# Altium project PCB_Project1.PrjPCB
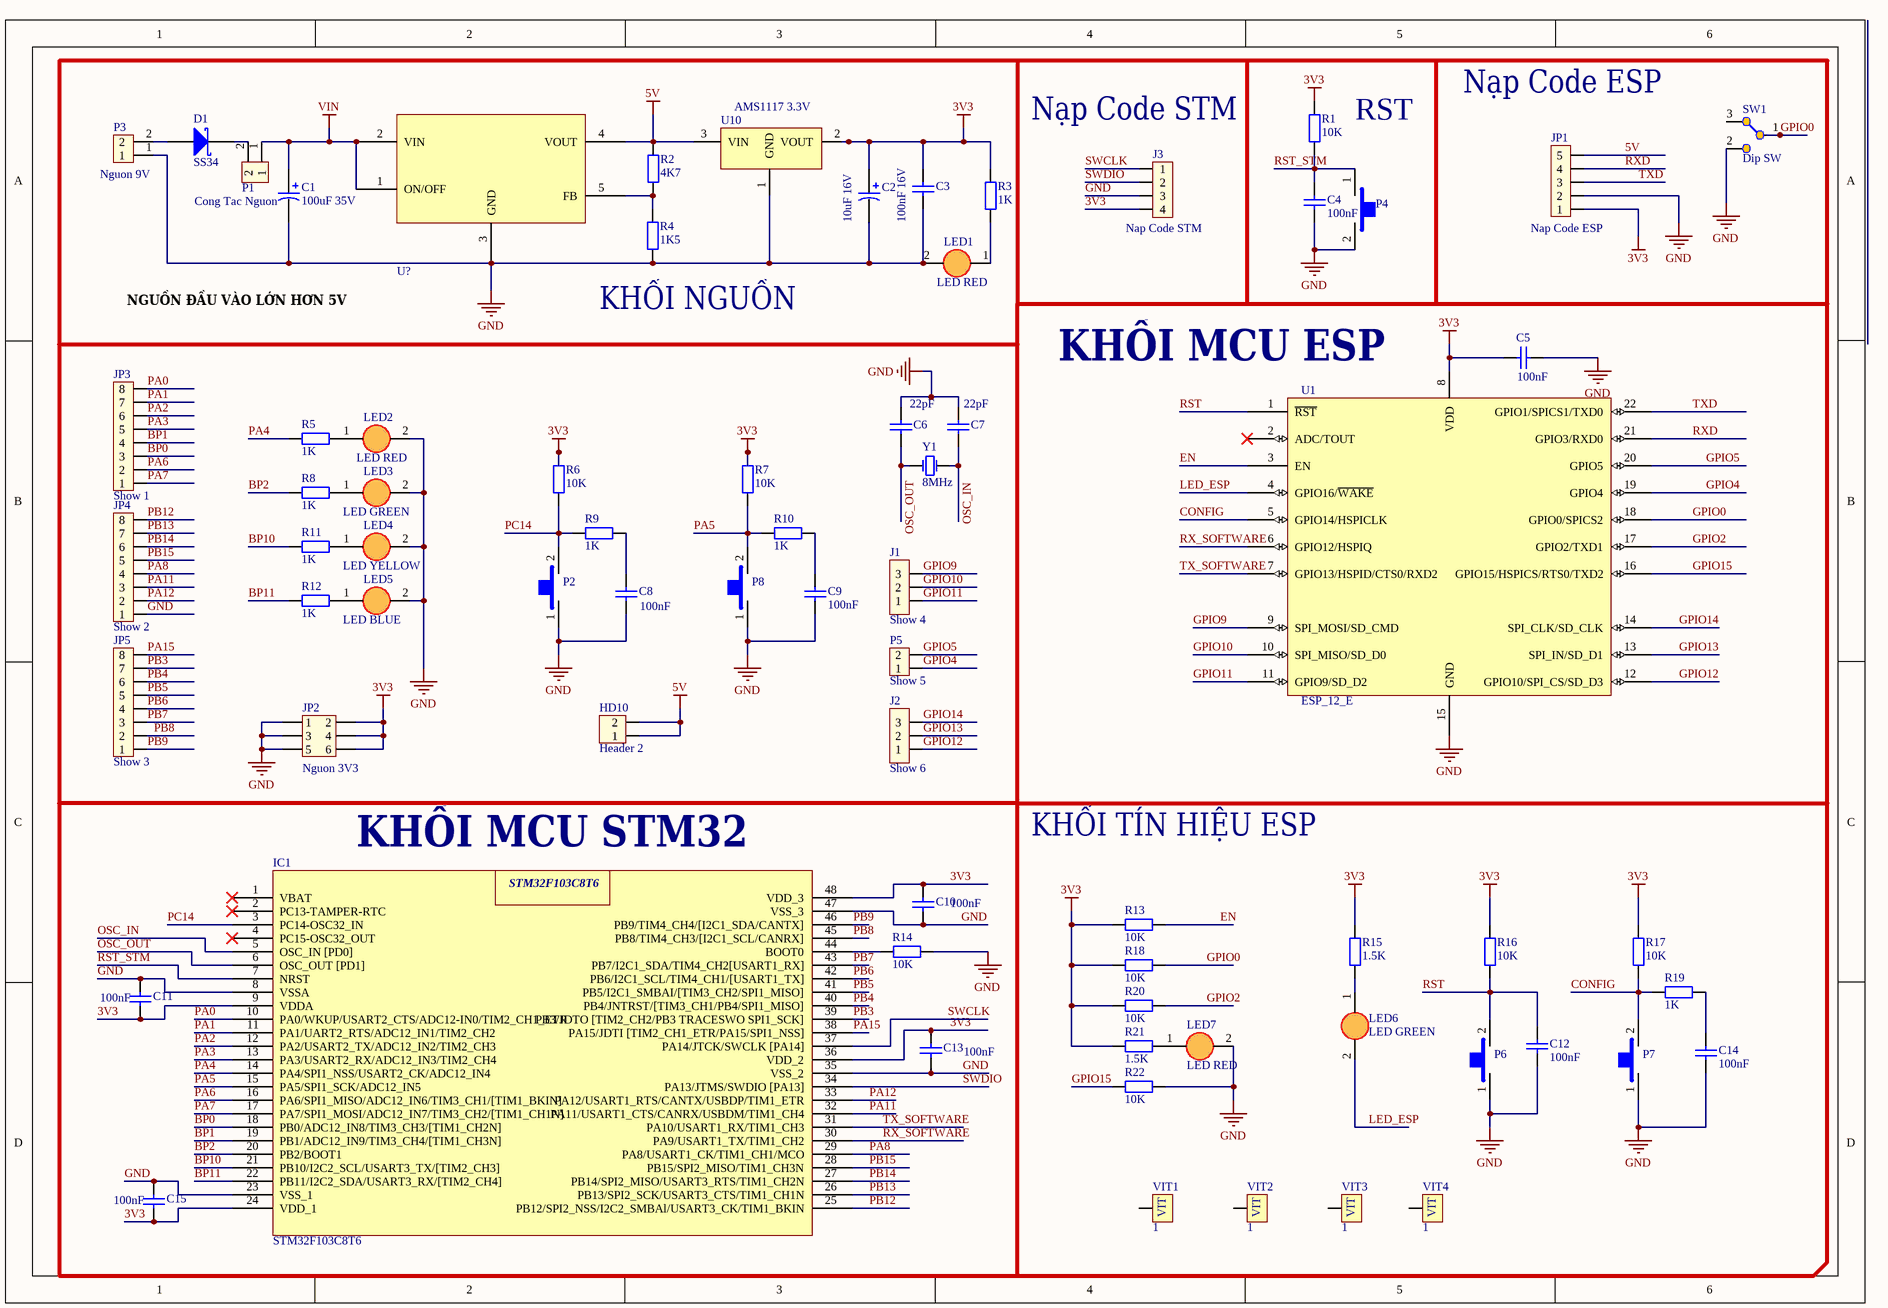
[diagram p0: Sheet1.SchDoc]
1 sheet, 72 parts. Net scope: global (net labels, ports and power ports of the same name join across sheets).

## Sheet Sheet1.SchDoc
size 350 x 241 mm

### Parts
C1  100uF 35V  [CAP_ALUM_SMD_100102_TYPE_G]
C2  10uF 16V  [CAP_ALUM_SMD_5054_TYPE_C]
C3  100nF 16V  [tu 0805]
C4  100nF  [tu 0805]
C5  100nF  [tu 0805]
C6  22pF  [tu 0805]
C7  22pF  [tu 0805]
C8  100nF  [tu 0805]
C9  100nF  [tu 0805]
C10  100nF  [tu 0805]
C11  100nF  [tu 0805]
C12  100nF  [tu 0805]
C13  100nF  [tu 0805]
C14  100nF  [tu 0805]
C15  100nF  [tu 0805]
D1  SS34  [DIODE_DO214AC_SMA]
HD10  Header 2  [Header_2]
IC1  STM32F103C8T6  [LQFP48]
J1  Show 4  [JP3]
J2  Show 6  [JP3]
J3  Nap Code STM  [jump don duc thang 2.54_4p]
JP1  Nap Code ESP  [jump don duc 2.54_5p]
JP2  Nguon 3V3  [Jump Doi Duc Thang 2.54_3x2]
JP3  Show 1  [Jump Don Duc Thang 2.54_8p]
JP4  Show 2  [Jump Don Duc Thang 2.54_8p]
JP5  Show 3  [Jump Don Duc Thang 2.54_8p]
LED1  LED RED  [led 0805]
LED2  LED RED  [led 0805]
LED3  LED GREEN  [led 0805]
LED4  LED YELLOW  [led 0805]
LED5  LED BLUE  [led 0805]
LED6  LED GREEN  [led 0805]
LED7  LED RED  [led 0805]
MIC?  U?  [Mic5V]
P1  Cong Tac Nguon  [Header Duc Thang 2P 2.54]
P2  (no value)  [SW 2P SMD]
P3  Nguon 9V  [Header Duc Thang 2P 2.54]
P4  (no value)  [SW 2P SMD]
P5  Show 5  [Jump don duc 2.54_2P]
P6  (no value)  [SW 2P SMD]
P7  (no value)  [SW 2P SMD]
P8  (no value)  [SW 2P SMD]
R1  10K  [tro 0805]
R2  4K7  [tro 0805]
R3  1K  [tro 0805]
R4  1K5  [tro 0805]
R5  1K  [tro 0805]
R6  10K  [tro 0805]
R7  10K  [tro 0805]
R8  1K  [tro 0805]
R9  1K  [tro 0805]
R10  1K  [tro 0805]
R11  1K  [tro 0805]
R12  1K  [tro 0805]
R13  10K  [tro 0805]
R14  10K  [tro 0805]
R15  1.5K  [tro 0805]
R16  10K  [tro 0805]
R17  10K  [tro 0805]
R18  10K  [tro 0805]
R19  1K  [tro 0805]
R20  10K  [tro 0805]
R21  1.5K  [tro 0805]
R22  10K  [tro 0805]
SW1  Dip SW  [SW3P]
U1  ESP_12_E  [ESP8266_12_E_L]
U10  AMS1117 3.3V  [SOT223]
VIT1  1  [VIT]
VIT2  1  [VIT]
VIT3  1  [VIT]
VIT4  1  [VIT]
Y1  8MHz  [thach anh 49s smd]

### Nets
3V3: C2.1 C3.1 C5.1 C10.1 C11.2 C13.1 C15.2 IC1.9(VDDA) IC1.24(VDD_1) IC1.36(VDD_2) IC1.48(VDD_3) J3.4 JP1.1 JP2.2 JP2.4 JP2.6 R1.1 R3.2 R6.1 R7.1 R13.2 R15.1 R16.1 R17.1 R18.2 R20.2 R21.2 U1.8(VDD) U10.2(VOUT)
5V: HD10.1 HD10.2 JP1.5 MIC?.4(VOUT) R2.2 U10.3(VIN)
GND: C1.2 C2.2 C3.2 C4.2 C5.2 C6.1 C7.1 C8.2 C9.2 C10.2 C11.1 C12.2 C13.2 C14.2 C15.1 IC1.8(VSSA) IC1.23(VSS_1) IC1.35(VSS_2) IC1.47(VSS_3) J3.3 JP1.2 JP2.1 JP2.3 JP2.5 JP4.1 LED1.2(K) LED2.2(K) LED3.2(K) LED4.2(K) LED5.2(K) LED7.2(K) MIC?.3(GND) P2.1 P3.1 P4.2 P6.1 P7.1 P8.1 R4.1 R14.1 R22.1 SW1.2(NC) U1.15(GND) U10.1(GND)
VIN: C1.1 MIC?.1(ON/OFF) MIC?.2(VIN) P1.1
BP0: IC1.18(PB0/ADC12_IN8/TIM3_CH3/[TIM1_CH2N]) JP3.3
BP1: IC1.19(PB1/ADC12_IN9/TIM3_CH4/[TIM1_CH3N]) JP3.4
BP2: IC1.20(PB2/BOOT1) R8.2
BP10: IC1.21(PB10/I2C2_SCL/USART3_TX/[TIM2_CH3]) R11.2
BP11: IC1.22(PB11/I2C2_SDA/USART3_RX/[TIM2_CH4]) R12.2
CONFIG: P7.2 R17.2 R19.2 U1.5(GPIO14/HSPICLK)
EN: R13.1 U1.3(EN)
GPIO0: R18.1 SW1.1(COM) U1.18(GPIO0/SPICS2)
GPIO2: R20.1 U1.17(GPIO2/TXD1)
GPIO4: P5.1 U1.19(GPIO4)
GPIO5: P5.2 U1.20(GPIO5)
GPIO9: J1.3 U1.9(SPI_MOSI/SD_CMD)
GPIO10: J1.2 U1.10(SPI_MISO/SD_D0)
GPIO11: J1.1 U1.11(GPIO9/SD_D2)
GPIO12: J2.1 U1.12(GPIO10/SPI_CS/SD_D3)
GPIO13: J2.2 U1.13(SPI_IN/SD_D1)
GPIO14: J2.3 U1.14(SPI_CLK/SD_CLK)
GPIO15: R22.2 U1.16(GPIO15/HSPICS/RTS0/TXD2)
LED_ESP: LED6.2(K) U1.4(GPIO16/~{WAKE})
OSC_IN: C7.2 IC1.5(OSC_IN_[PD0]) Y1.2(OSC2)
OSC_OUT: C6.2 IC1.6(OSC_OUT_[PD1]) Y1.1(OSC1)
PA0: IC1.10(PA0/WKUP/USART2_CTS/ADC12-IN0/TIM2_CH1_ETR) JP3.8
PA1: IC1.11(PA1/UART2_RTS/ADC12_IN1/TIM2_CH2) JP3.7
PA2: IC1.12(PA2/USART2_TX/ADC12_IN2/TIM2_CH3) JP3.6
PA3: IC1.13(PA3/USART2_RX/ADC12_IN3/TIM2_CH4) JP3.5
PA4: IC1.14(PA4/SPI1_NSS/USART2_CK/ADC12_IN4) R5.2
PA5: IC1.15(PA5/SPI1_SCK/ADC12_IN5) P8.2 R7.2 R10.2
PA6: IC1.16(PA6/SPI1_MISO/ADC12_IN6/TIM3_CH1/[TIM1_BKIN]) JP3.2
PA7: IC1.17(PA7/SPI1_MOSI/ADC12_IN7/TIM3_CH2/[TIM1_CH1N]) JP3.1
PA8: IC1.29(PA8/USART1_CK/TIM1_CH1/MCO) JP4.4
PA11: IC1.32(PA11/USART1_CTS/CANRX/USBDM/TIM1_CH4) JP4.3
PA12: IC1.33(PA12/USART1_RTS/CANTX/USBDP/TIM1_ETR) JP4.2
PA15: IC1.38(PA15/JDTI_[TIM2_CH1_ETR/PA15/SPI1_NSS]) JP5.8
PB3: IC1.39(PB3/JDTO_[TIM2_CH2/PB3_TRACESWO_SPI1_SCK]) JP5.7
PB4: IC1.40(PB4/JNTRST/[TIM3_CH1/PB4/SPI1_MISO]) JP5.6
PB5: IC1.41(PB5/I2C1_SMBAI/[TIM3_CH2/SPI1_MISO]) JP5.5
PB6: IC1.42(PB6/I2C1_SCL/TIM4_CH1/[USART1_TX]) JP5.4
PB7: IC1.43(PB7/I2C1_SDA/TIM4_CH2[USART1_RX]) JP5.3
PB8: IC1.45(PB8/TIM4_CH3/[I2C1_SCL/CANRX]) JP5.2
PB9: IC1.46(PB9/TIM4_CH4/[I2C1_SDA/CANTX]) JP5.1
PB12: IC1.25(PB12/SPI2_NSS/I2C2_SMBAl/USART3_CK/TIM1_BKIN) JP4.8
PB13: IC1.26(PB13/SPI2_SCK/USART3_CTS/TIM1_CH1N) JP4.7
PB14: IC1.27(PB14/SPI2_MISO/USART3_RTS/TIM1_CH2N) JP4.6
PB15: IC1.28(PB15/SPI2_MISO/TIM1_CH3N) JP4.5
PC14: IC1.3(PC14-OSC32_IN) P2.2 R6.2 R9.2
RST: C12.1 P6.2 R16.2 U1.1(~{RST})
RST_STM: C4.1 IC1.7(NRST) P4.1 R1.2
RX_SOFTWARE: IC1.30(PA9/USART1_TX/TIM1_CH2) U1.6(GPIO12/HSPIQ)
RXD: JP1.4 U1.21(GPIO3/RXD0)
SWCLK: IC1.37(PA14/JTCK/SWCLK_[PA14]) J3.1
SWDIO: IC1.34(PA13/JTMS/SWDIO_[PA13]) J3.2
TX_SOFTWARE: IC1.31(PA10/USART1_RX/TIM1_CH3) U1.7(GPIO13/HSPID/CTS0/RXD2)
TXD: JP1.3 U1.22(GPIO1/SPICS1/TXD0)
NetC8_1: C8.1 R9.1
NetC9_1: C9.1 R10.1
NetC14_1: C14.1 R19.1
NetD1_1: D1.1(A) P3.2
NetD1_2: D1.2(K) P1.2
NetIC1_44: IC1.44(BOOT0) R14.2
NetLED1_1: LED1.1(A) R3.1
NetLED2_1: LED2.1(A) R5.1
NetLED3_1: LED3.1(A) R8.1
NetLED4_1: LED4.1(A) R11.1
NetLED5_1: LED5.1(A) R12.1
NetLED6_1: LED6.1(A) R15.2
NetLED7_1: LED7.1(A) R21.1
NetMIC?_5: MIC?.5(FB) R2.1 R4.2

Not connected (* = marked no-connect by the designer): IC1 1(VBAT)* 2(PC13-TAMPER-RTC)* 4(PC15-OSC32_OUT)*; SW1 3(NO); U1 2(ADC/TOUT)*; VIT1 VIT1(1); VIT2 VIT1(1); VIT3 VIT1(1); VIT4 VIT1(1)

### Notes on the sheet
- Nạp Code ESP
- (near J3) Nạp Code STM
- (near R1) RST
- NGUỒN ĐẦU VÀO LỚN HƠN 5V
- (near R4) KHỐI NGUỒN
- (near U1) KHỐI MCU ESP
- KHỐI MCU STM32
- KHỐI TÍN HIỆU ESP

### Library data of the parts
C1 = EEE-FK1C331P: CAP ALUM 330uF 20% 35V SMD; MFR: Panasonic; Value: 330uF/35V; Solder: SMT; MPN: EEE-FK1C331P; Category: CAPACITOR; PinCount: 2
C2 = EEE-FK1C330P: CAP ALUM 33uF 20% 16V SMD; MFR: Panasonic; Value: 33uF/16V; Solder: SMT; MPN: EEE-FK1C330P; Category: CAPACITOR; PinCount: 2
C3-C15 = Tu 0805 22pF 50V 10%: Dán; Don_Vi: Con; So_Chan: 2; Ten_Linh_Kien: Tụ 0805 22P 10% 50V; Ma_Hang: MH004560; Chung_Loai: Dán; Kieu_Chan: *
D1 = SS34: DIODE SCHOTTKY 40V 3A SMA; Solder: SMT; MPN: SS34; Value: SS34; MFR: *
HD10 = Header2: Value: Header 2
IC1 = STM32F103C8T6: Dán; Ten_Linh_Kien: STM32F103C8T6 LQFP48; Ma_Hang: MH000567; Don_Vi: Con; So_Chan: 48; Kieu_Chan: LQFP48; Chung_Loai: Dán
J1 J2 = JP3: Jumper 3; Value: J3
J3 = Jump Don Duc Thang 2.54_4P: Cắm; Don_Vi: Con; Ma_Hang: MH000903; So_Chan: 4; Ten_Linh_Kien: Jump Đơn Đực 2.54MM 1x40P Thẳng 11MM; Kieu Chan: *; Chung_Loai: Cắm
JP1 = Jump Don Duc 2.54_5P: Cắm; Ten_Linh_Kien: Jump Đơn Đực 2.54MM 2x40P Thẳng 11MM; Don_Vi: Con; So_Chan: 5; Ma_Hang: MH000903; Kieu_Chan: *; Chung_Loai: Cắm
JP2 = Jump Doi Duc Thang 2.54_3x2: Cắm; Don_Vi: Con; Ma_Hang: MH002686; Ten_Linh_Kien: Jump Đôi Đực 2.54MM 2x40P Thẳng 11MM; Chung_Loai: Cắm
JP3-JP5 = Jump Don Duc 2.54_8P: Cắm; Ten_Linh_Kien: Jump Đơn Đực 2.54MM 1x40P Thẳng 11MM; Ma_Hang: MH000903; Don_Vi: Con; Ghi_Chu: *; Kieu Chan: *; Chung_Loai: Cắm
LED1-LED7 = Led 0805 Do: Dán; Don_Vi: Con; So_Chan: 2; Ten_Linh_Kien: LED 0805 Màu Đỏ; Ma_Hang: MH000897; Chung_Loai: Dán; Kieu_Chan: *
MIC? = Mic5V: 3A
P1 P3 = Header 2.0-2p: Dán; Chung_Loai: Cắm; Don_Vi: Con; Ten_Linh_Kien: Header 2P PH2.0-2P Đực Thẳng; Ma_Hang: MH006499
P2 P4 P6-P8 = Button 2 SMD: SMD Mini Push Button Switch 2 Pin 3x6x2.7mm; MPN: SMD Mini Push Button 2 SMD; Link: https://ram-e-shop.com/product/press2pin-smd/
P5 = Jum don duc 2.54_2P: Cắm; Don_Vi: Con; Kieu_Chan: Jump don duc 2.54; So_Chan: 2; Ma_Hang: MH000903; Ten_Linh_Kien: Jum đơn đực 2.54MM 1X40P Thẳng 11MM; Chung_Loai: Cắm
R1-R22 = Tro 0805 5% 10k: Dán; Don_Vi: Con; So_Chan: 2; Ten_Linh_Kien: Trở 0805 5% 10k; Ma_Hang: MH005239; Chung_Loai: Dán; Kieu_Chan: *
SW1 = Switch3P: Dip Switch 3 pin
U1 = ESP_12_E: ESP-12 Wi-Fi Module by AI-Thinker; IC: ESP8266EX; Vendor: AI-Thinker; Value: ESP_12_E
U10 = AMS1117 3.3V: Dán; Ten_Linh_Kien: AMS1117-3.3V SOT223; Don_Vi: Con; So_Chan: 4; Ma_Hang: MH000596; Kieu_Chan: SOT223; Chung_Loai: Dán
VIT1-VIT4 = VIT: Oc Vit
Y1 = Thach anh 8MHz 49S SMD: Dán; Kieu_Chan: 49S SMD; Don_Vi: Con; So_Chan: 2; Ten_Linh_Kien: Thạch anh 8MHz 49S SMD; Ma_Hang: MH001985; Chung_Loai: Dán